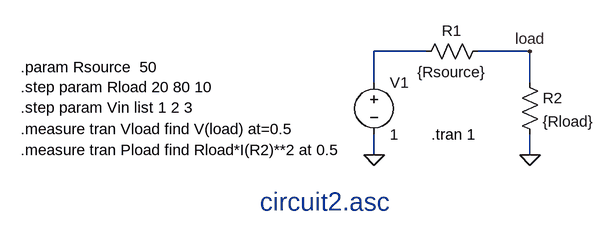
[diagram p0: schematic circuit2.asc]
circuit2.asc, the LTspice schematic file:
Version 4
SHEET 1 880 680
WIRE 96 208 16 208
WIRE 256 208 176 208
WIRE 16 256 16 208
WIRE 256 256 256 208
WIRE 16 368 16 336
WIRE 256 368 256 336
FLAG 16 368 0
FLAG 256 368 0
FLAG 256 208 load
SYMBOL voltage 16 240 R0
SYMATTR InstName V1
SYMATTR Value 1
SYMBOL res 240 240 R0
SYMATTR InstName R2
SYMATTR Value {Rload}
SYMBOL res 192 192 R90
WINDOW 0 0 56 VBottom 2
WINDOW 3 32 56 VTop 2
SYMATTR InstName R1
SYMATTR Value {Rsource}
TEXT -528 232 Left 2 !.param Rsource  50\n.step param Rload 20 80 10\n.step param Vin list 1 2 3
TEXT -528 328 Left 2 !.measure tran Vload find V(load) at=0.5
TEXT -528 360 Left 2 !.measure tran Pload find Rload*I(R2)**2 at 0.5
TEXT 104 336 Left 2 !.tran 1
TEXT -160 440 Left 4 ;circuit2.asc

The netlist it stands for:
* circuit2.asc
V1 N001 0 1
R2 load 0 {Rload}
R1 load N001 {Rsource}
.param Rsource  50
.step param Rload 20 80 10
.step param Vin list 1 2 3
.measure tran Vload find V(load) at=0.5
.measure tran Pload find Rload*I(R2)**2 at 0.5
.tran 1
* circuit2.asc
.backanno
.end